# EAGLE design CanBus-8x-Schalter (EAGLE 7.7.0)

## Sheet 1 of 3
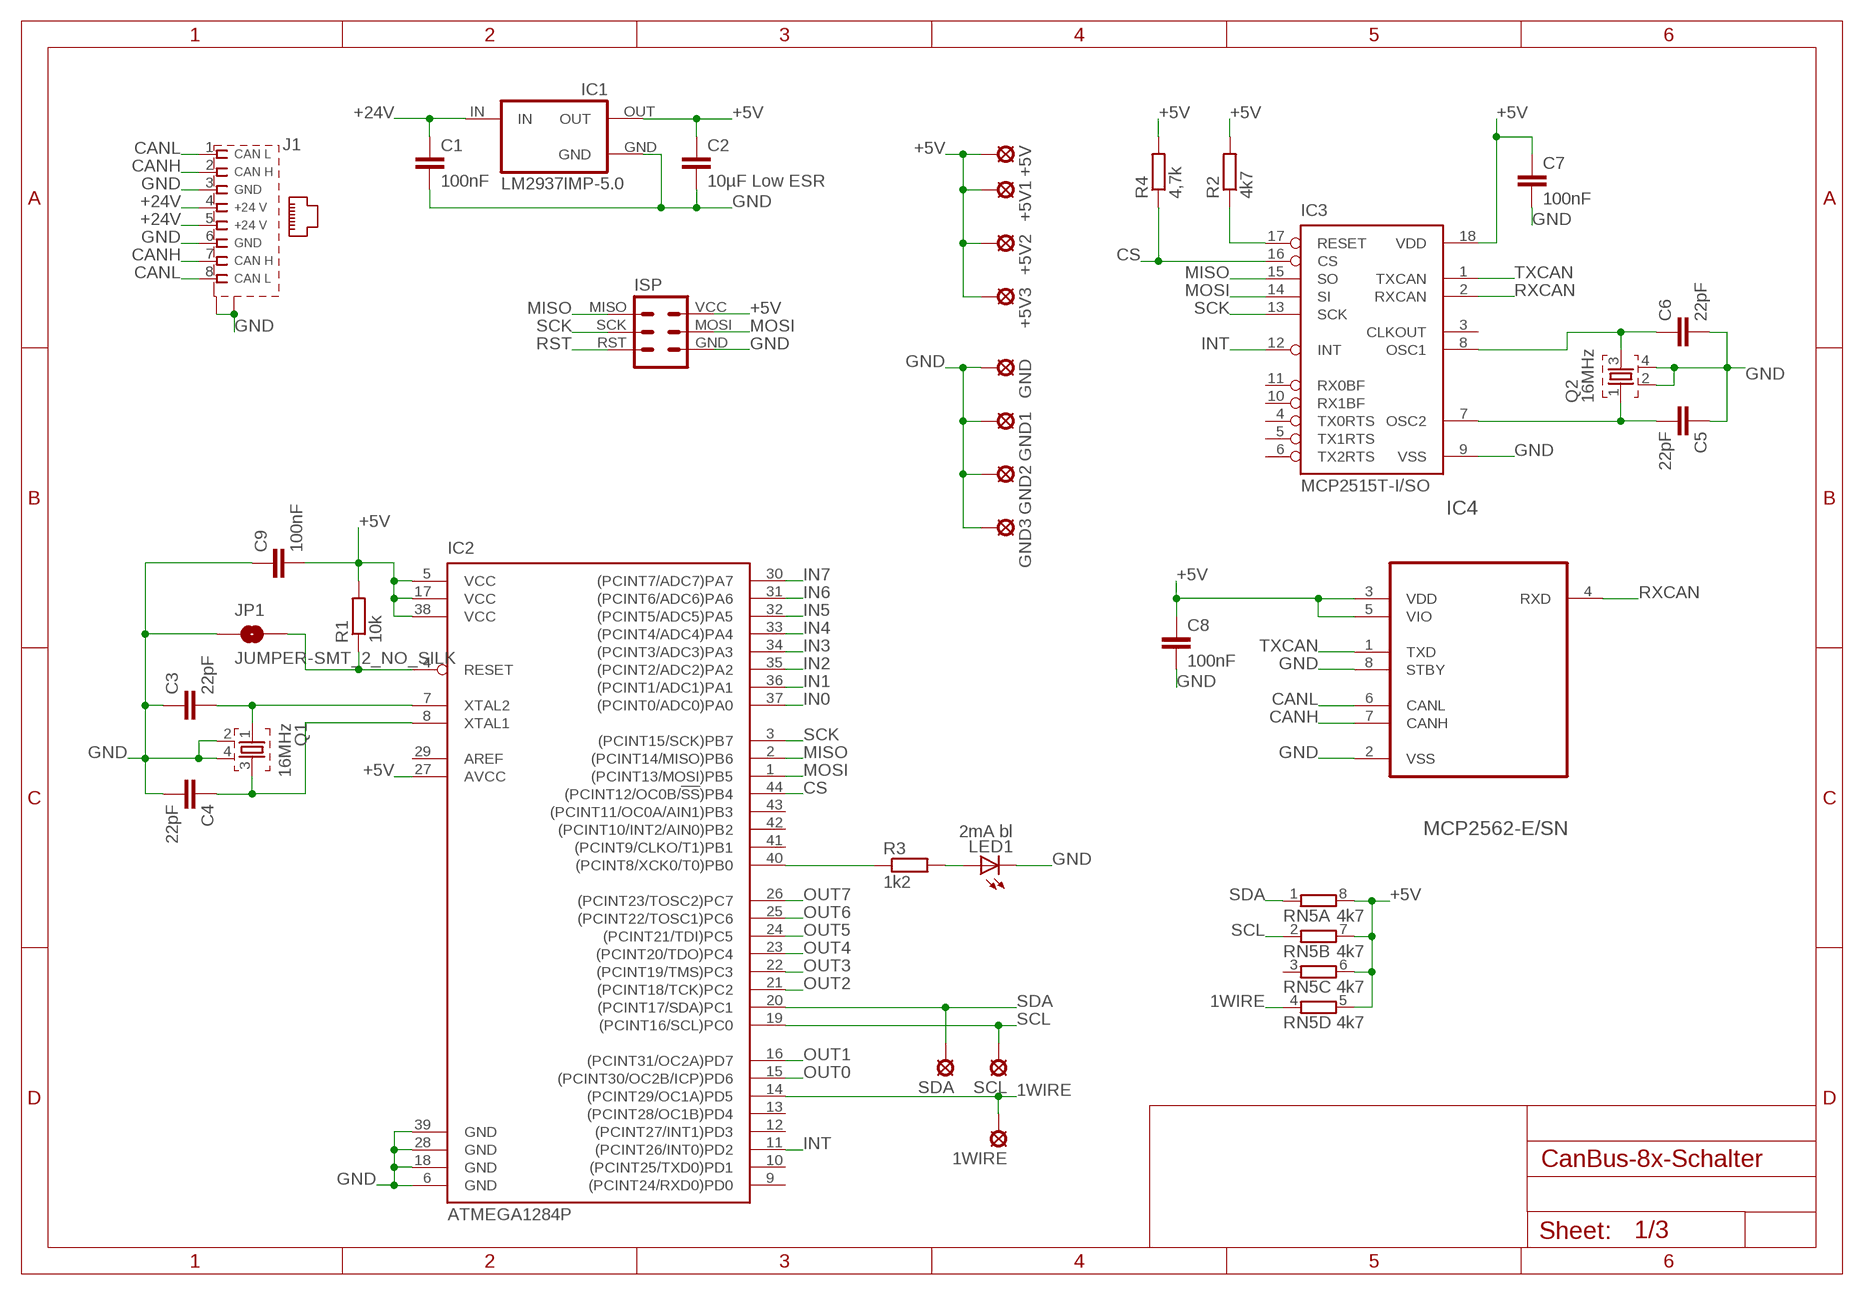
[diagram p0: schematic, sheet 1]

### Parts
1WIRE  LSP13  [LSP13]
+5V  LSP13  [LSP13]
+5V1  LSP13  [LSP13]
+5V2  LSP13  [LSP13]
+5V3  LSP13  [LSP13]
C1  100nF  C-EUC0805  [C0805]
C2  10µF Low ESR  C-EUC0805  [C0805]
C3  22pF  C-EUC0805  [C0805]
C4  22pF  C-EUC0805  [C0805]
C5  22pF  C-EUC0805  [C0805]
C6  22pF  C-EUC0805  [C0805]
C7  100nF  C-EUC0805  [C0805]
C8  100nF  C-EUC0805  [C0805]
C9  100nF  C-EUC0805  [C0805]
GND  LSP13  [LSP13]
GND1  LSP13  [LSP13]
GND2  LSP13  [LSP13]
GND3  LSP13  [LSP13]
IC1  LM2937IMP-5.0  [SOT223]
IC2  ATMEGA1284P  ATMEGA644A  [TQFP44]
IC3  MCP2515T-I/SO  [SO18L]
IC4  MCP2562-E/SN  [SO08]
ISP  ISPVIAS-ONLY-1.27MM  [ISP-VIAS-ONLY-1.27MM]
J1  RJ45-CAN  [MEBP_8-8G]
JP1  JUMPER-SMT_2_NO_SILK  [SMT-JUMPER_2_NO_SILK]
LED1  2mA bl  LEDCHIPLED_1206  [CHIPLED_1206]
Q1  16MHz  EUROQUARTZ-MMJ  [MJ-5X3.2]
Q2  16MHz  EUROQUARTZ-MMJ  [MJ-5X3.2]
R1  10k  R-EU_R0805  [R0805]
R2  4k7  R-EU_R0805  [R0805]
R3  1k2  R-EU_R0805  [R0805]
R4  4,7k  R-EU_R0805  [R0805]
RN5  4k7  4R-N0603-ARC  [0603-ARC]
SCL  LSP13  [LSP13]
SDA  LSP13  [LSP13]

### Nets
1WIRE: 1WIRE.MP IC2.14((PCINT29/OC1A)PD5) RN5.4
+5V: +5V1.MP +5V2.MP +5V3.MP +5V.MP C2.1 C7.1 C8.1 C9.2 IC1.OUT IC2.5(VCC) IC2.17(VCC) IC2.27(AVCC) IC2.38(VCC) IC3.18(VDD) IC4.3(VDD) IC4.5(VIO) ISP.VCC R1.2 R2.2 R4.2 RN5.5 RN5.6 RN5.7 RN5.8 ; also sheet 2
+24V: C1.1 IC1.IN J1.4 J1.5 ; also sheet 3
CANH: IC4.7(CANH) J1.2 J1.7
CANL: IC4.6(CANL) J1.1 J1.8
CS: IC2.44((PCINT12/OC0B/!SS!)PB4) IC3.16(CS) R4.1
GND: C1.2 C2.2 C3.1 C4.2 C5.1 C6.2 C7.2 C8.2 C9.1 GND1.MP GND2.MP GND3.MP GND.MP IC1.GND IC2.6(GND) IC2.18(GND) IC2.28(GND) IC2.39(GND) IC3.9(VSS) IC4.2(VSS) IC4.8(STBY) ISP.GND J1.3 J1.6 J1.G1(S1) J1.G2(S2) JP1.1 LED1.C Q1.2 Q1.4 Q2.2 Q2.4 ; also sheet 2,3
IN0: IC2.37((PCINT0/ADC0)PA0) ; also sheet 2
IN1: IC2.36((PCINT1/ADC1)PA1) ; also sheet 2
IN2: IC2.35((PCINT2/ADC2)PA2) ; also sheet 2
IN3: IC2.34((PCINT3/ADC3)PA3) ; also sheet 2
IN4: IC2.33((PCINT4/ADC4)PA4) ; also sheet 2
IN5: IC2.32((PCINT5/ADC5)PA5) ; also sheet 2
IN6: IC2.31((PCINT6/ADC6)PA6) ; also sheet 2
IN7: IC2.30((PCINT7/ADC7)PA7) ; also sheet 2
INT: IC2.11((PCINT26/INT0)PD2) IC3.12(INT)
MISO: IC2.2((PCINT14/MISO)PB6) IC3.15(SO) ISP.MISO
MOSI: IC2.1((PCINT13/MOSI)PB5) IC3.14(SI) ISP.MOSI
N$1: IC3.17(RESET) R2.1
N$9: IC2.40((PCINT8/XCK0/T0)PB0) R3.1
N$10: LED1.A R3.2
OUT0: IC2.15((PCINT30/OC2B/ICP)PD6) ; also sheet 3
OUT1: IC2.16((PCINT31/OC2A)PD7) ; also sheet 3
OUT2: IC2.21((PCINT18/TCK)PC2) ; also sheet 3
OUT3: IC2.22((PCINT19/TMS)PC3) ; also sheet 3
OUT4: IC2.23((PCINT20/TDO)PC4) ; also sheet 3
OUT5: IC2.24((PCINT21/TDI)PC5) ; also sheet 3
OUT6: IC2.25((PCINT22/TOSC1)PC6) ; also sheet 3
OUT7: IC2.26((PCINT23/TOSC2)PC7) ; also sheet 3
RST: IC2.4(RESET) ISP.RST JP1.2 R1.1
RXCAN: IC3.2(RXCAN) IC4.4(RXD)
SCK: IC2.3((PCINT15/SCK)PB7) IC3.13(SCK) ISP.SCK
SCL: IC2.19((PCINT16/SCL)PC0) RN5.2 SCL.MP
SDA: IC2.20((PCINT17/SDA)PC1) RN5.1 SDA.MP
TXCAN: IC3.1(TXCAN) IC4.1(TXD)
XTAL1: C3.2 IC2.7(XTAL2) Q1.1
XTAL2: C4.1 IC2.8(XTAL1) Q1.3
XTAL3: C5.2 IC3.7(OSC2) Q2.1
XTAL4: C6.1 IC3.8(OSC1) Q2.3
Unconnected: IC2.9((PCINT24/RXD0)PD0) IC2.10((PCINT25/TXD0)PD1) IC2.12((PCINT27/INT1)PD3) IC2.13((PCINT28/OC1B)PD4) IC2.29(AREF) IC2.41((PCINT9/CLKO/T1)PB1) IC2.42((PCINT10/INT2/AIN0)PB2) IC2.43((PCINT11/OC0A/AIN1)PB3) IC3.3(CLKOUT) IC3.4(TX0RTS) IC3.5(TX1RTS) IC3.6(TX2RTS) IC3.10(RX1BF) IC3.11(RX0BF) RN5.3

## Sheet 2 of 3
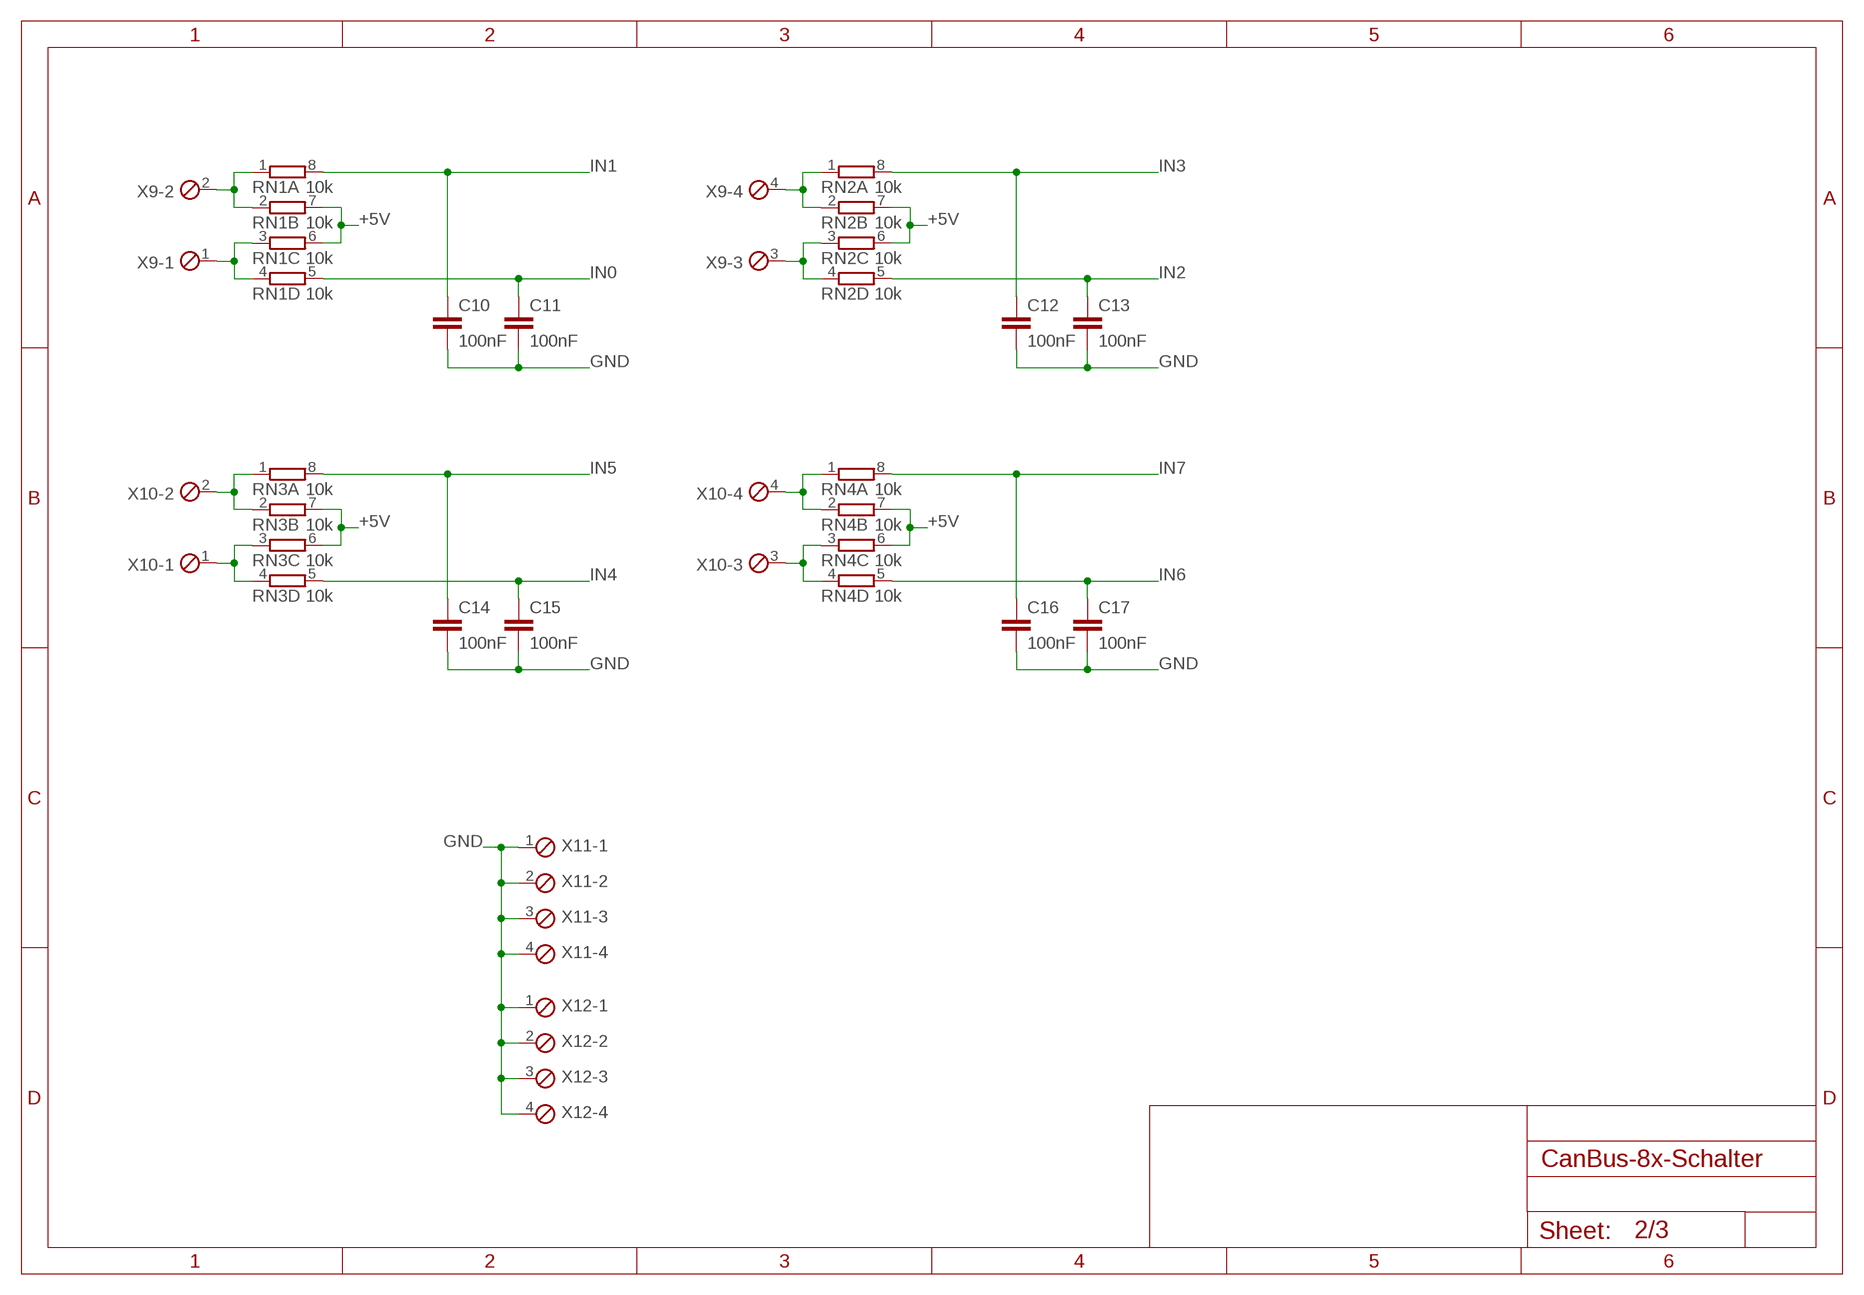
[diagram p1: schematic, sheet 2]

### Parts
C10  100nF  C-EUC0805  [C0805]
C11  100nF  C-EUC0805  [C0805]
C12  100nF  C-EUC0805  [C0805]
C13  100nF  C-EUC0805  [C0805]
C14  100nF  C-EUC0805  [C0805]
C15  100nF  C-EUC0805  [C0805]
C16  100nF  C-EUC0805  [C0805]
C17  100nF  C-EUC0805  [C0805]
RN1  10k  4R-N0603-ARC  [0603-ARC]
RN2  10k  4R-N0603-ARC  [0603-ARC]
RN3  10k  4R-N0603-ARC  [0603-ARC]
RN4  10k  4R-N0603-ARC  [0603-ARC]
X9  MPT4  [4POL254]
X10  MPT4  [4POL254]
X11  MPT4  [4POL254]
X12  MPT4  [4POL254]

### Nets
+5V: RN1.6 RN1.7 RN2.6 RN2.7 RN3.6 RN3.7 RN4.6 RN4.7 ; also sheet 1
GND: C10.2 C11.2 C12.2 C13.2 C14.2 C15.2 C16.2 C17.2 X11.1 X11.2 X11.3 X11.4 X12.1 X12.2 X12.3 X12.4 ; also sheet 1,3
IN0: C11.1 RN1.5 ; also sheet 1
IN1: C10.1 RN1.8 ; also sheet 1
IN2: C13.1 RN2.5 ; also sheet 1
IN3: C12.1 RN2.8 ; also sheet 1
IN4: C15.1 RN3.5 ; also sheet 1
IN5: C14.1 RN3.8 ; also sheet 1
IN6: C17.1 RN4.5 ; also sheet 1
IN7: C16.1 RN4.8 ; also sheet 1
N$2: RN3.3 RN3.4 X10.1
N$3: RN3.1 RN3.2 X10.2
N$5: RN1.3 RN1.4 X9.1
N$6: RN1.1 RN1.2 X9.2
N$7: RN4.3 RN4.4 X10.3
N$8: RN4.1 RN4.2 X10.4
N$26: RN2.3 RN2.4 X9.3
N$27: RN2.1 RN2.2 X9.4

## Sheet 3 of 3
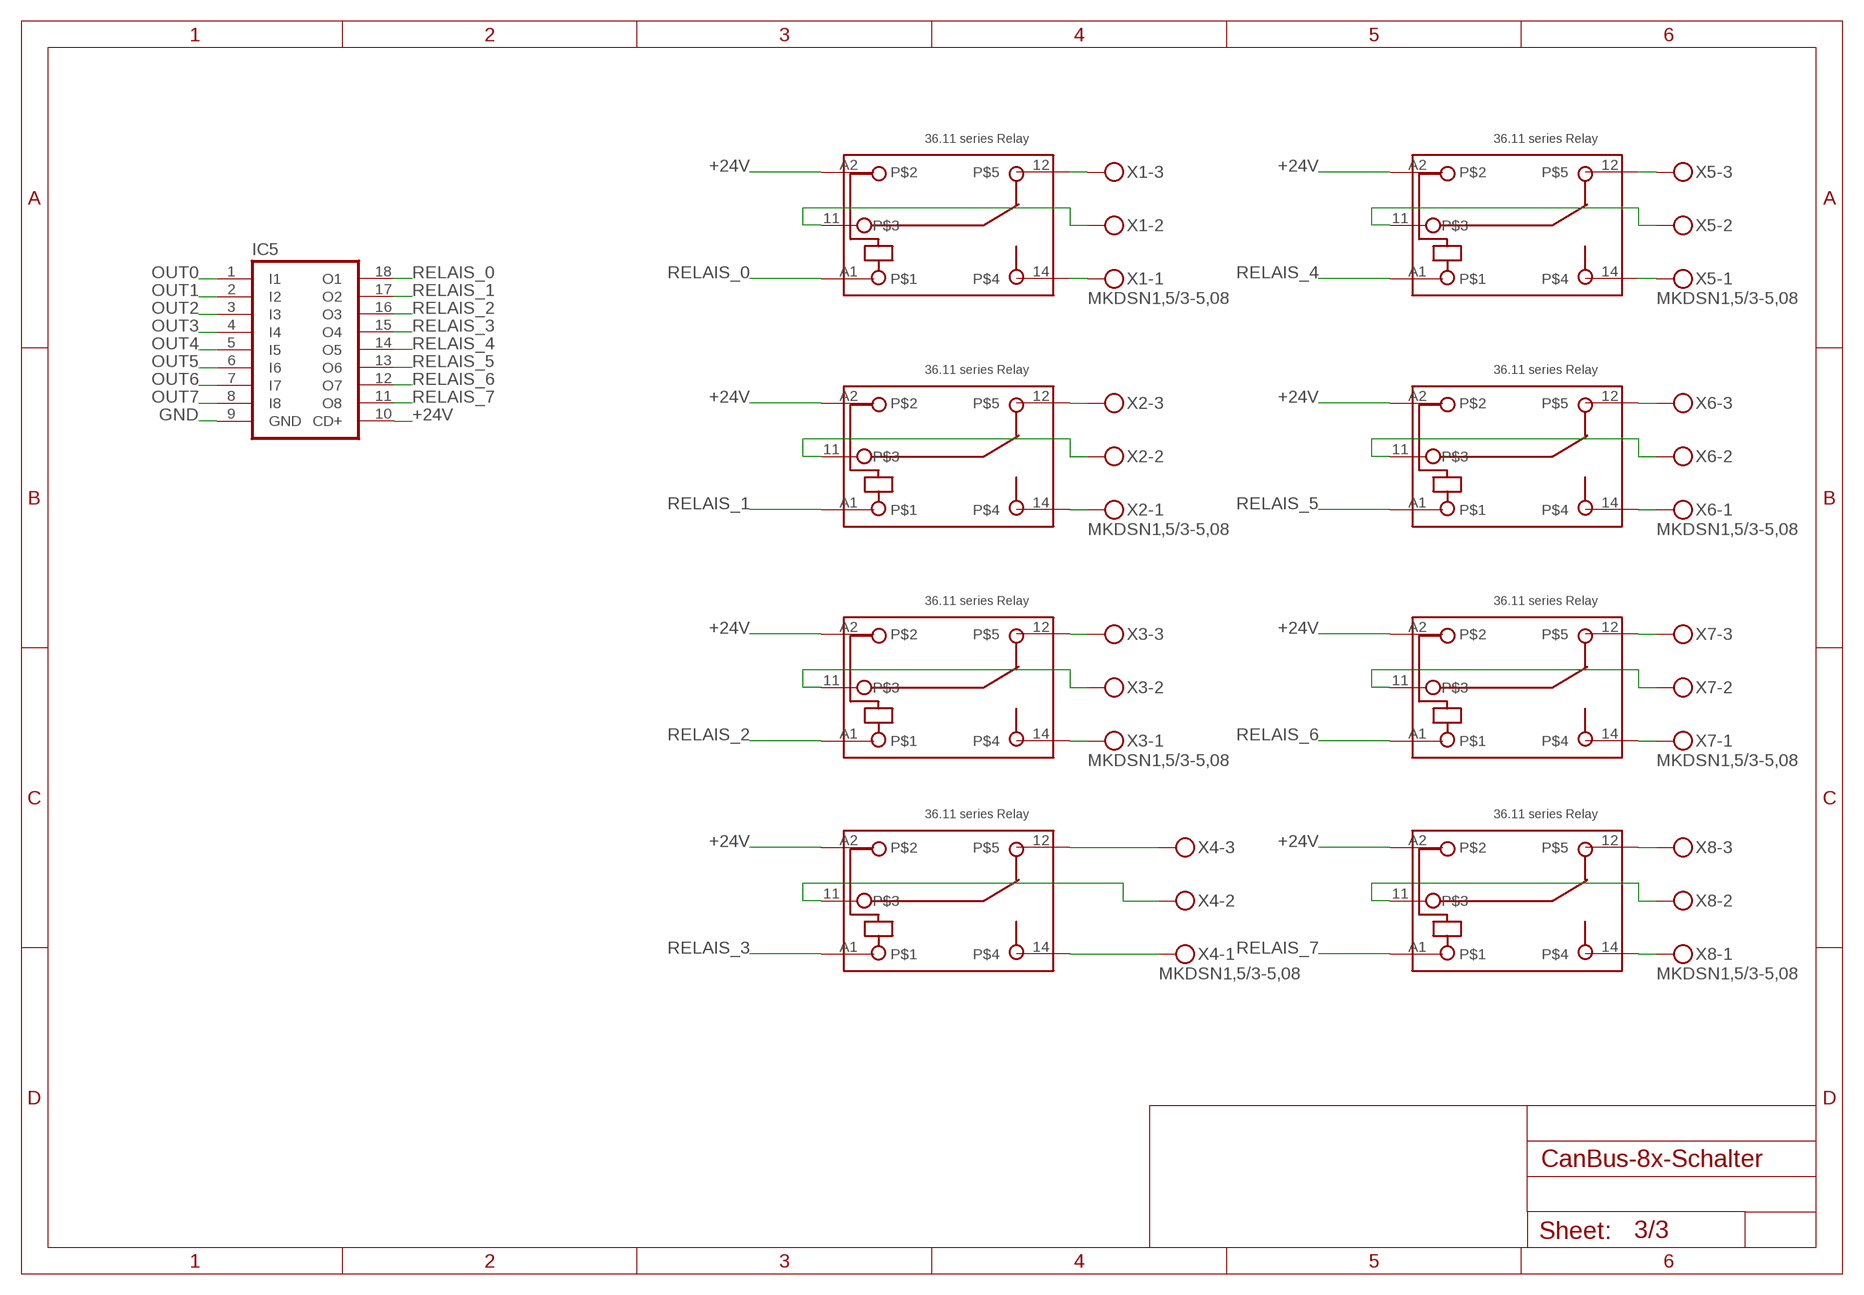
[diagram p2: schematic, sheet 3]

### Parts
IC5  ULN2803A-SO18W  [SO18W]
K1  36.11  [36.11]
K2  36.11  [36.11]
K3  36.11  [36.11]
K4  36.11  [36.11]
K5  36.11  [36.11]
K6  36.11  [36.11]
K7  36.11  [36.11]
K8  36.11  [36.11]
X1  MKDSN1,5/3-5,08  [MKDSN1,5/3-5,08]
X2  MKDSN1,5/3-5,08  [MKDSN1,5/3-5,08]
X3  MKDSN1,5/3-5,08  [MKDSN1,5/3-5,08]
X4  MKDSN1,5/3-5,08  [MKDSN1,5/3-5,08]
X5  MKDSN1,5/3-5,08  [MKDSN1,5/3-5,08]
X6  MKDSN1,5/3-5,08  [MKDSN1,5/3-5,08]
X7  MKDSN1,5/3-5,08  [MKDSN1,5/3-5,08]
X8  MKDSN1,5/3-5,08  [MKDSN1,5/3-5,08]

### Nets
+24V: IC5.10(CD+) K1.A2 K2.A2 K3.A2 K4.A2 K5.A2 K6.A2 K7.A2 K8.A2 ; also sheet 1
GND: IC5.9(GND) ; also sheet 1,2
N$12 [230V]: K2.12 X2.3
N$13 [230V]: K2.14 X2.1
N$14 [230V]: K2.11 X2.2
N$15 [230V]: K1.12 X1.3
N$16 [230V]: K1.14 X1.1
N$17 [230V]: K1.11 X1.2
N$18 [230V]: K3.12 X3.3
N$19 [230V]: K3.14 X3.1
N$20 [230V]: K3.11 X3.2
N$21 [230V]: K4.12 X4.3
N$22 [230V]: K4.14 X4.1
N$23 [230V]: K4.11 X4.2
N$28 [230V]: K6.12 X6.3
N$29 [230V]: K6.14 X6.1
N$30 [230V]: K6.11 X6.2
N$31 [230V]: K5.12 X5.3
N$32 [230V]: K5.14 X5.1
N$33 [230V]: K5.11 X5.2
N$34 [230V]: K7.12 X7.3
N$35 [230V]: K7.14 X7.1
N$36 [230V]: K7.11 X7.2
N$37 [230V]: K8.12 X8.3
N$38 [230V]: K8.14 X8.1
N$39 [230V]: K8.11 X8.2
OUT0: IC5.1(I1) ; also sheet 1
OUT1: IC5.2(I2) ; also sheet 1
OUT2: IC5.3(I3) ; also sheet 1
OUT3: IC5.4(I4) ; also sheet 1
OUT4: IC5.5(I5) ; also sheet 1
OUT5: IC5.6(I6) ; also sheet 1
OUT6: IC5.7(I7) ; also sheet 1
OUT7: IC5.8(I8) ; also sheet 1
RELAIS_0: IC5.18(O1) K1.A1
RELAIS_1: IC5.17(O2) K2.A1
RELAIS_2: IC5.16(O3) K3.A1
RELAIS_3: IC5.15(O4) K4.A1
RELAIS_4: IC5.14(O5) K5.A1
RELAIS_5: IC5.13(O6) K6.A1
RELAIS_6: IC5.12(O7) K7.A1
RELAIS_7: IC5.11(O8) K8.A1

## Power pins joined to a net without a drawn wire
GND: IC1.GND@(GND)

## Library data of the parts
1WIRE +5V +5V1-+5V3 GND GND1-GND3 SCL SDA = solpad:LSP13: SOLDER PAD drill 1.3 mm, distributor Buerklin, 12H562
C1-C17 = rcl:C-EU: CAPACITOR, European symbol
IC1 = lm2937:LM2937IMP-*: 400 and 500 mA Low Dropout Voltage Regulator NATIONAL SEMICONDUCTOR created by Peter.Hofmann@ph-tronic.de <mailto:Reter.Hofmann@ph-tronic.de> 10-2004 Rev.0
IC2 = atmel:ATMEGA644: 8-bit Microcontroller with 64K Bytes In-System Programmable Flash Source: http://www.atmel.com/dyn/resources/prod_documents/doc2593.pdf; MPN: ATMEGA644PV-10AU; OC_FARNELL: 1455123; OC_NEWARK: 58M3748
IC3 = mcp2515_2551_2562:MCP2515
IC4 = mcp2515_2551_2562:MCP2562: High-Speed CAN Transceiver,DIP-8
IC5 = uln-udn:ULN2803A: DRIVER ARRAY
ISP = pogo-isp:ISP: ISP connector pads for Pogo ISP There are variants for mixed pads/vias, pads only and vias.
J1 = can-bus:RJ45-CAN: RJ45 CAN-Bus Reichelt Bestell-Nr.: MEBP 8-8G
JP1 = SparkFun-Jumpers:JUMPER-SMT_2_NO: Normally open jumper This jumper has two pads in close proximity to each other. Apply solder to close the connection. Round pads are easier to solder for beginners, but are a lot larger. SparkFun Product that uses the round pads: SparkFun EL Sequencer <https://www.sparkfun.com/products/12781>
K1-K8 = relay_finder_36_11:36.11: Printed circuit mount miniature 10 A relay one pole changeover contacts Conform RoHS
LED1 = led:LED: LED OSRAM: - CHIPLED LG R971, LG N971, LY N971, LG Q971, LY Q971, LO R971, LY R971 LH N974, LH R974 LS Q976, LO Q976, LY Q976 LO Q996 - Hyper CHIPLED LW Q18S LB Q993, LB Q99A, LB R99A - SideLED LS A670, LO A670, LY A670, LG A670, LP A670 LB A673, LV A673, LT A673, LW A673 LH A674 LY A675 LS A676, LA A676, LO A676, LY A676, LW A676 LS A679, LY A679, LG A679 - Hyper Micro SIDELED® LS Y876, LA Y876, LO Y876, LY Y876 LT Y87S - SmartLED LW L88C, LW L88S LB L89C, LB L89S, LG L890 LS L89K, LO L89K, LY L89K LS L896, LA L896, LO L896, LY L896 - TOPLED LS T670, LO T670, LY T670, LG T670, LP T670 LSG T670, LSP T670, LSY T670, LOP T670, LYG T670 LG T671, LOG T671, LSG T671 LB T673, LV T673, LT T673, LW T673 LH T674 LS T676, LA T676, LO T676, LY T676, LB T676, LH T676, LSB T676, LW T676 LB T67C, LV T67C, LT T67C, LS T67K, LO T67K, LY T67K, LW E67C LS E67B, LA E67B, LO E67B, LY E67B, LB E67C, LV E67C, LT E67C LW T67C LS T679, LY T679, LG T679 LS T770, LO T770, LY T770, LG T770, LP T770 LB T773, LV T773, LT T773, LW T773 LH T774 LS E675, LA E675, LY E675, LS T675 LS T776, LA T776, LO T776, LY T776, LB T776 LHGB T686 LT T68C, LB T68C - Hyper Mini TOPLED® LB M676 - Mini TOPLED Santana® LG M470 LS M47K, LO M47K, LY M47K Source: http://www.osram.convergy.de LUXEON: - LUMILED® LXK2-PW12-R00, LXK2-PW12-S00, LXK2-PW14-U00, LXK2-PW14-V00 LXK2-PM12-R00, LXK2-PM12-S00, LXK2-PM14-U00 LXK2-PE12-Q00, LXK2-PE12-R00, LXK2-PE12-S00, LXK2-PE14-T00, LXK2-PE14-U00 LXK2-PB12-K00, LXK2-PB12-L00, LXK2-PB12-M00, LXK2-PB14-N00, LXK2-PB14-P00, LXK2-PB14-Q00 LXK2-PR12-L00, LXK2-PR12-M00, LXK2-PR14-Q00, LXK2-PR14-R00 LXK2-PD12-Q00, LXK2-PD12-R00, LXK2-PD12-S00 LXK2-PH12-R00, LXK2-PH12-S00 LXK2-PL12-P00, LXK2-PL12-Q00, LXK2-PL12-R00 Source: www.luxeon.com KINGBRIGHT: KA-3528ASYC Source: www.kingbright.com
Q1 Q2 = crystal-smd:EUROQUARTZ-M*: Keramik-SMD-Quarz, 5x7x1,2mm EUROQUARTZ MQ2 Crystal, 4 pad Soruce: MQ <https://cdn-reichelt.de/documents/datenblatt/B400/MQ.pdf>, MJ <https://cdn-reichelt.de/documents/datenblatt/B400/MJ.pdf>; REICHELT: 16,000000-MJ
R1-R4 = rcl:R-EU_: RESISTOR, European symbol
RN1-RN5 = resistor-dil:4R-N: Array Chip Resistor Source: RS Component / Phycomp; OC_FARNELL: unknown; OC_NEWARK: unknown
X1-X8 = con-phoenix-508:MKDSN1,5/3-5,08: MKDSN 1,5/ 3-5,08 Printklemme Nennstrom: 13,5 A Nennspannung: 250 V Rastermaß: 5,08 mm Polzahl: 3 Anschlussart: Schraubanschluss Montage: Löten Anschlussrichtung Leiter/Platine: 0 ° Artikelnummer: 1729131 Source: http://eshop.phoenixcontact.com .. 1729131.pdf
X9-X12 = con-phoenix-254:MPT4: PHOENIX CONNECTOR; OC_FARNELL: unknown; OC_NEWARK: unknown

## Net classes
1 230V: width 2.54 mm, clearance 2.54 mm

## Board
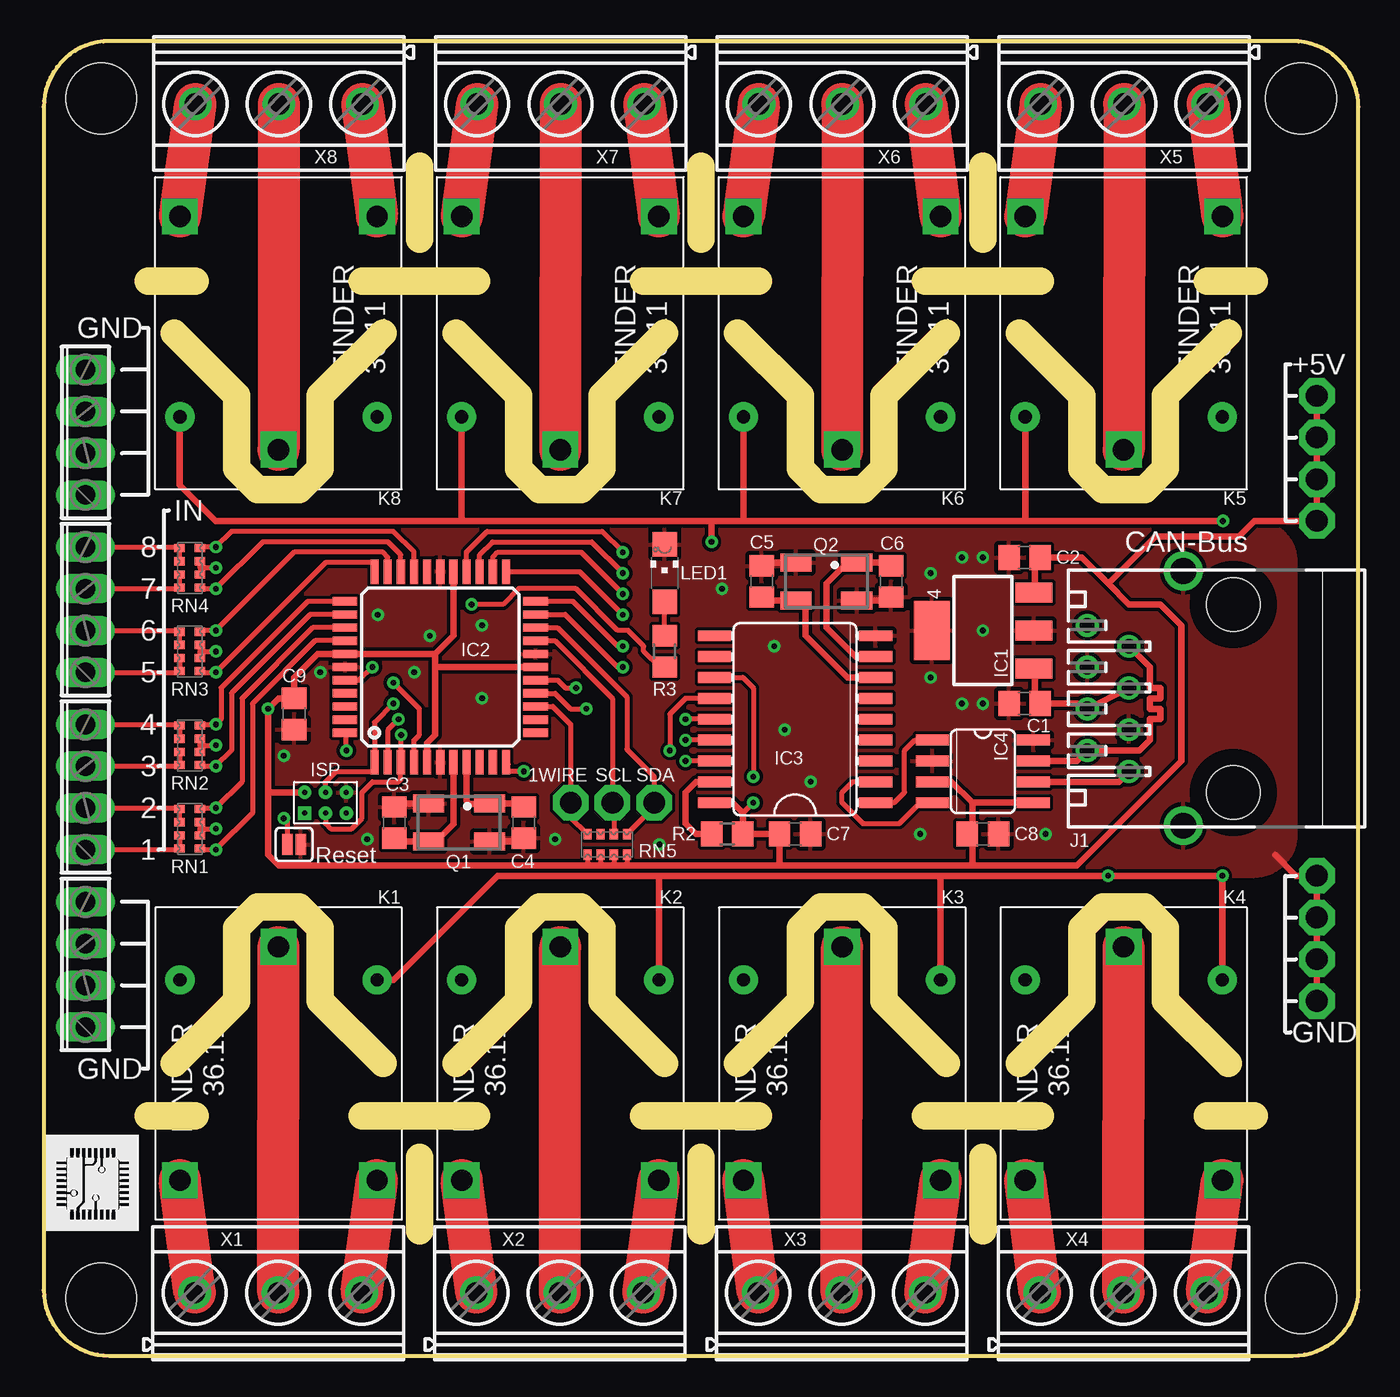
[diagram p3: board, top side]
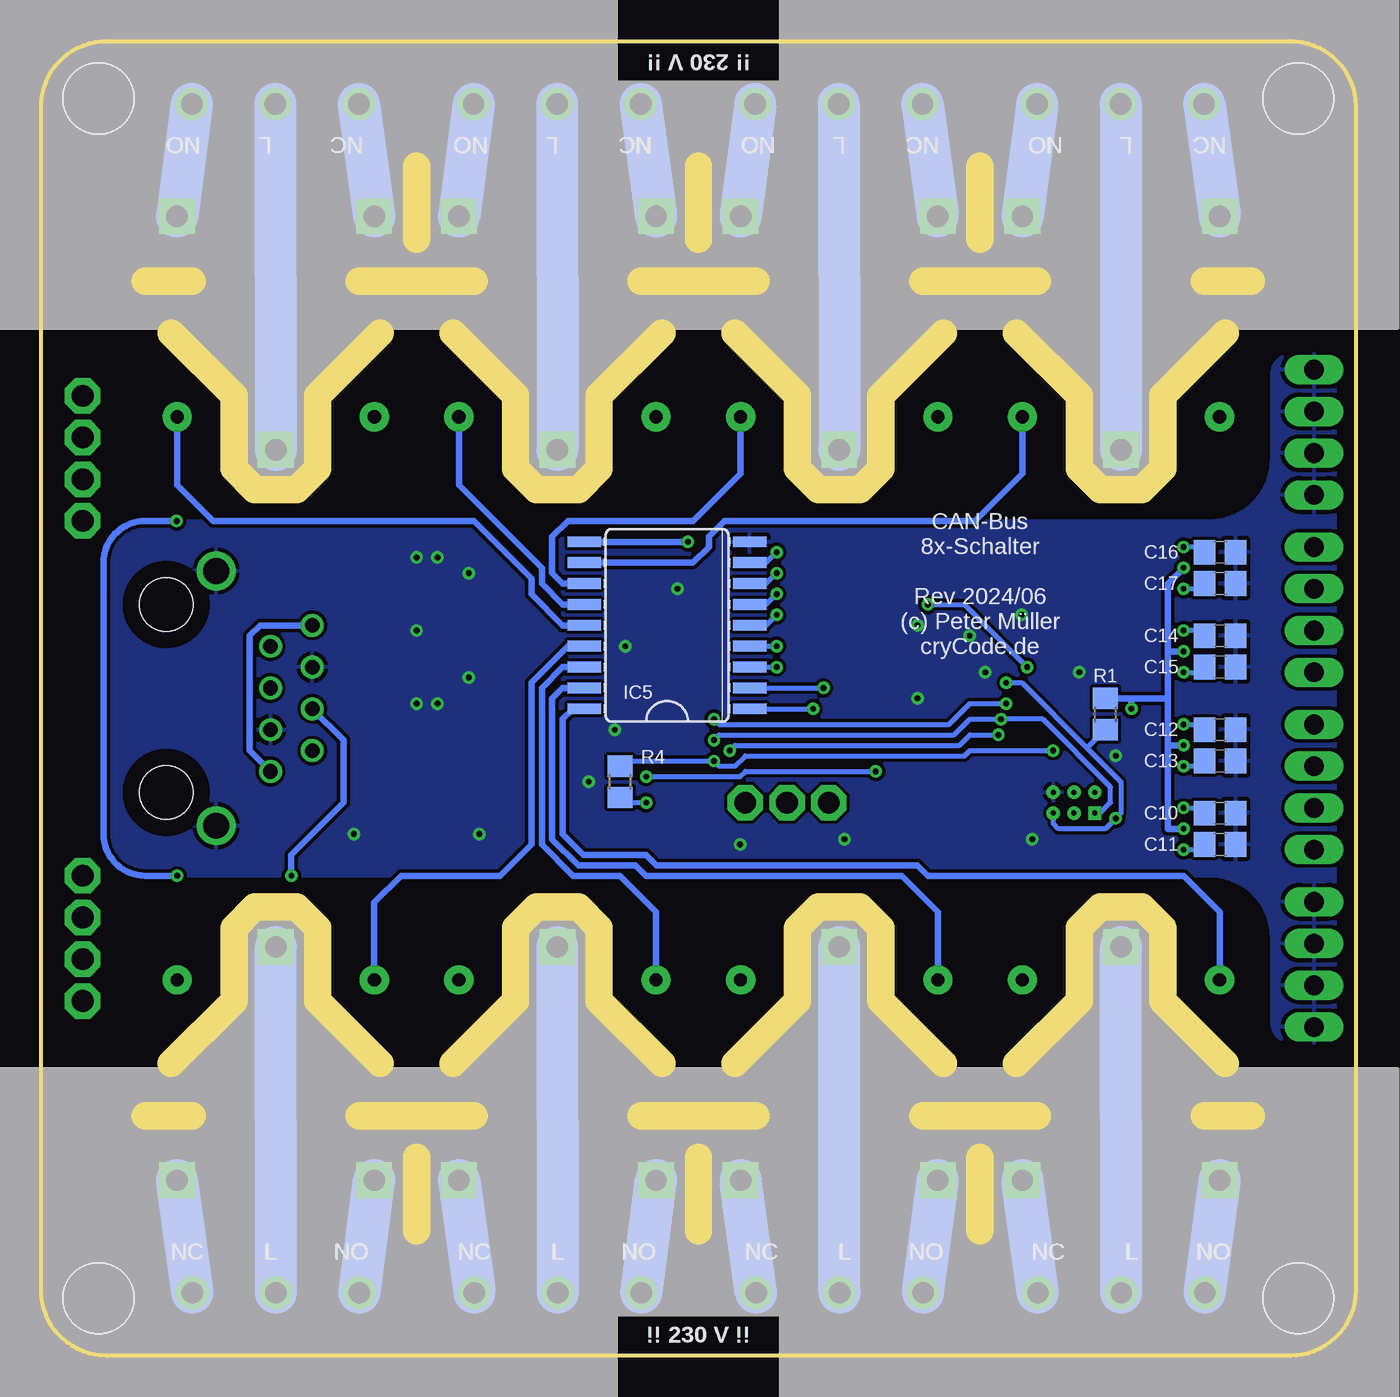
[diagram p4: board, bottom side, seen from below]

Size 80 x 80 mm. Coordinates in mm from the lower left corner, seen from the top.
Outline: 4,0 76,0 arc90 80,4 80,76 arc90 76,80 4,80 arc90 0,76 0,4 arc90 4,0
Copper layers (1*16): Top 0.035mm / dielectric 1.5mm / Bottom 0.035mm
Design rules "allpcb2 *": minimum track width 8mil, minimum drill 0.3mm, track to track 8mil, track to pad 8mil, pad to pad 8mil, via to via 8mil, smd to smd 6mil, copper to edge 40mil, drill to drill 8mil, minimum pad ring 10mil, minimum via ring 8mil, stop-mask expansion 0.1mm, vias tented up to drill 0.5mm, thermal gap 10mil
Holes 4.3 mm at 3.5,3.5 76.5,3.5 76.5,76.5 3.5,76.5
Milling: 72 lines

### Footprints (pad centres in the part's own frame; a part is rotated, then mirrored left to right if it is on the bottom)
LSP13 = drill 1.321 pad 2.159 octagon: MP 0,0
C0805 = smd 1.3 x 1.5: 1 -0.95,0; 2 0.95,0
SOT223 = smd 1.219 x 2.235: GND 0,-3.099; IN -2.311,-3.099; OUT 2.311,-3.099 | smd 3.6 x 2.2: GND@ 0,3.099
TQFP44 = smd 1.5 x 0.5: 1 -5.8,4; 2 -5.8,3.2; 3 -5.8,2.4; 4 -5.8,1.6; 5 -5.8,0.8; 6 -5.8,0; 7 -5.8,-0.8; 8 -5.8,-1.6; 9 -5.8,-2.4; 10 -5.8,-3.2; 11 -5.8,-4; 23 5.8,-4; 24 5.8,-3.2; 25 5.8,-2.4; 26 5.8,-1.6; 27 5.8,-0.8; 28 5.8,0; 29 5.8,0.8; 30 5.8,1.6; 31 5.8,2.4; 32 5.8,3.2; 33 5.8,4 | smd 0.5 x 1.5: 12 -4,-5.8; 13 -3.2,-5.8; 14 -2.4,-5.8; 15 -1.6,-5.8; 16 -0.8,-5.8; 17 0,-5.8; 18 0.8,-5.8; 19 1.6,-5.8; 20 2.4,-5.8; 21 3.2,-5.8; 22 4,-5.8; 34 4,5.8; 35 3.2,5.8; 36 2.4,5.8; 37 1.6,5.8; 38 0.8,5.8; 39 0,5.8; 40 -0.8,5.8; 41 -1.6,5.8; 42 -2.4,5.8; 43 -3.2,5.8; 44 -4,5.8
SO18L = smd 0.66 x 2.032: 1 -5.08,-4.902; 2 -3.81,-4.902; 3 -2.54,-4.902; 4 -1.27,-4.902; 5 0,-4.902; 6 1.27,-4.902; 7 2.54,-4.902; 8 3.81,-4.902; 9 5.08,-4.902; 10 5.08,4.902; 11 3.81,4.902; 12 2.54,4.902; 13 1.27,4.902; 14 0,4.902; 15 -1.27,4.902; 16 -2.54,4.902; 17 -3.81,4.902; 18 -5.08,4.902
SO08 = smd 0.66 x 2.032: 1 -1.905,-3.073; 2 -0.635,-3.073; 3 0.635,-3.073; 4 1.905,-3.073; 5 1.905,3.073; 6 0.635,3.073; 7 -0.635,3.073; 8 -1.905,3.073
SO18W = smd 0.66 x 2.032: 1 -5.08,-5.029; 2 -3.81,-5.029; 3 -2.54,-5.029; 4 -1.27,-5.029; 5 0,-5.029; 6 1.27,-5.029; 7 2.54,-5.029; 8 3.81,-5.029; 9 5.08,-5.029; 10 5.08,5.029; 11 3.81,5.029; 12 2.54,5.029; 13 1.27,5.029; 14 0,5.029; 15 -1.27,5.029; 16 -2.54,5.029; 17 -3.81,5.029; 18 -5.08,5.029
ISP-VIAS-ONLY-1.27MM = drill 0.3 pad 0.762: GND 0.635,-1.27; MOSI 0.635,0; RST -0.635,-1.27; SCK -0.635,0; VCC 0.635,1.27 | drill 0.3 pad 0.762 square: MISO -0.635,1.27
MEBP_8-8G = drill 0.889: 1 -4.445,6.35; 2 -3.175,8.89; 3 -1.905,6.35; 4 -0.635,8.89; 5 0.635,6.35; 6 1.905,8.89; 7 3.175,6.35; 8 4.445,8.89 | drill 1.575 pad 2.184: G1 -7.745,3.05; G2 7.745,3.05 | hole 3.251: -5.715,0; 5.715,0
SMT-JUMPER_2_NO_SILK = smd 0.635 x 1.27: 1 -0.406,0; 2 0.406,0
36.11 = drill 1.3 pad 2.184 square: 11 -7.1,0; 12 7.1,6; 14 7.1,-6 | drill 0.8 pad 1.778: A1 -5.1,-6; A2 -5.1,6
CHIPLED_1206 = smd 1.5 x 1.5: A 0,-1.75; C 0,1.75
MJ-5X3.2 = smd 1.9 x 1.1: 1 -1.85,-1.15; 2 1.85,-1.15; 3 1.85,1.15; 4 -1.85,1.15
R0805 = smd 1.3 x 1.5: 1 -0.95,0; 2 0.95,0
0603-ARC = smd 0.5 x 0.65: 1 -1.2,-0.625; 2 -0.4,-0.625; 3 0.4,-0.625; 4 1.2,-0.625; 5 1.2,0.625; 6 0.4,0.625; 7 -0.4,0.625; 8 -1.2,0.625
MKDSN1,5/3-5,08 = drill 1.3 pad 2: 1 -7.641,0.025; 2 -2.561,0.025; 3 2.519,0.025
4POL254 = drill 1.2 long: 1 -3.81,0; 2 -1.27,0; 3 1.27,0; 4 3.81,0

### Placement (x,y rotation side)
1WIRE  32.07,33.66 0 top
+5V  77.47,50.8 0 top
+5V1  77.47,53.34 0 top
+5V2  77.47,55.88 0 top
+5V3  77.47,58.42 0 top
C1  59.69,39.69 180 top
C2  59.69,48.58 180 top
C3  21.34,32.45 270 top
C4  29.21,32.45 270 top
C5  43.69,47.12 270 top
C6  51.56,47.12 270 top
C7  45.72,31.75 0 top
C8  57.15,31.75 0 top
C9  15.24,39.05 90 top
C10  8.26,33.02 0 bottom
C11  8.26,31.11 0 bottom
C12  8.26,38.1 0 bottom
C13  8.26,36.2 0 bottom
C14  8.26,43.81 0 bottom
C15  8.26,41.91 0 bottom
C16  8.26,48.9 0 bottom
C17  8.26,46.99 0 bottom
GND  77.47,29.21 0 top
GND1  77.47,26.67 0 top
GND2  77.47,24.13 0 top
GND3  77.47,21.59 0 top
IC1  57.15,44.13 90 top
IC2  24.13,41.91 90 top
IC3  45.72,38.73 90 top
IC4  57.15,35.56 270 top
IC5  41.91,44.45 90 bottom
ISP  17.14,33.66 90 top
J1  72.39,40 90 top
JP1  15.24,31.11 180 top
K1  14.29,17.78 270 top
K2  31.43,17.78 270 top
K3  48.58,17.78 270 top
K4  65.72,17.78 270 top
K5  65.72,62.23 90 top
K6  48.58,62.23 90 top
K7  31.43,62.23 90 top
K8  14.29,62.23 90 top
LED1  37.78,47.62 0 top
Q1  25.27,32.45 0 top
Q2  47.62,47.12 0 top
R1  15.24,39.05 90 bottom
R2  41.59,31.75 0 top
R3  37.78,42.86 90 top
R4  44.77,34.92 270 bottom
RN1  8.89,32.07 270 top
RN2  8.89,37.15 270 top
RN3  8.89,42.86 270 top
RN4  8.89,47.94 270 top
RN5  34.29,31.11 180 top
SCL  34.61,33.66 0 top
SDA  37.15,33.66 0 top
U$1  [30MM_LOGO]  0,7.62 0 top
X1  16.83,3.81 0 top
X2  33.97,3.81 0 top
X3  51.12,3.81 0 top
X4  68.26,3.81 0 top
X5  63.18,76.2 180 top
X6  46.04,76.2 180 top
X7  28.89,76.2 180 top
X8  11.75,76.2 180 top
X9  2.54,34.61 90 top
X10  2.54,45.4 90 top
X11  2.54,56.2 90 top
X12  2.54,23.81 90 top

### Tracks (layer width: path | path; a pad name or v marks a point on that pad's centre or on a via)
1WIRE
  Top 0.305: IC2.14 30.98,39.51 32.07,38.42 1WIRE.MP 32.07,32.76 RN5.4
+5V  (via drill 0.35 pad 0.7)
  Top 0.305: RN1.7 RN1.6 9.52,32.07 v10.48,32.07 | RN4.6 RN4.7 9.52,47.94 v10.48,47.94 | RN3.7 RN3.6 9.52,42.86 v10.48,42.86 | RN2.6 RN2.7 9.52,37.15 v10.48,37.15 | RN5.8 35.49,29.84 35.56,29.84 | RN5.7 34.69,29.84 34.29,29.84 33.89,29.84 RN5.6 | RN5.5 33.09,29.84 33.02,29.84 | v43.18,33.66 42.55,33.02 42.54,33.02
  Top 0.406: IC1.OUT 60.45,46.65 60.33,46.78 60.33,48.26 C2.1 | 40.32,33.66 IC3.18 41.91,33.66 42.54,33.02 R2.2 C7.1 44.77,29.84 | 56.52,33.66 55.24,34.92 IC4.3 | IC4.5 56.52,33.66 | 60.33,48.89 C2.1 | IC2.5 23.33,37.3 23.81,37.78 23.81,41.91 | 44.77,29.84 35.56,29.84 34.29,29.84 33.02,29.84 14.29,29.84 13.65,30.48 13.65,34.29 | 44.77,29.84 56.52,29.84 | 64.77,46.99 66.04,45.72 67.94,45.72 69.22,44.45 69.22,36.2 62.87,29.84 56.52,29.84 | 64.77,46.99 63.18,48.58 C2.1 | 56.52,29.84 56.52,31.75 C8.1 56.52,31.75 56.52,33.66 | 23.81,42.71 IC2.38 16.68,42.71 15.24,41.27 C9.2 14.93,40.01 14.29,40.01 v13.65,39.37 13.65,34.29 | 23.81,41.91 IC2.17 | IC2.27 24.93,43.83 23.81,42.71 | 23.81,41.91 23.81,42.71 | +5V3.MP +5V2.MP +5V1.MP +5V.MP 73.66,50.8 72.71,49.85 67.63,49.85 64.77,46.99 | ISP.VCC 13.65,34.29
  Bottom 0.305: R4.2 44.45,33.66 v43.18,33.66
  Bottom 0.406: 11.43,37.15 11.43,32.07 v10.48,32.07 | 11.43,37.15 11.43,40.01 | 11.43,40.01 11.43,42.86 | 11.43,42.86 11.43,46.99 v10.48,47.94 | v10.48,42.86 11.43,42.86 | v10.48,37.15 11.43,37.15 | 13.65,40.01 C9.2 | 13.65,40.01 11.43,40.01 | v13.65,39.37 13.65,40.01
+24V  (via drill 0.35 pad 0.7)
  Top 0.406: IC1.IN 60.45,41.62 60.33,41.49 60.33,40 C1.1 | 60.33,39.37 C1.1 | K8.A2 8.29,52.99 10.48,50.8 25.43,50.8 | 25.43,50.8 40.64,50.8 | 40.64,50.8 42.58,50.8 | 42.58,50.8 59.72,50.8 | 59.72,50.8 v71.75,50.8 | K7.A2 25.43,50.8 | K6.A2 42.58,50.8 | K5.A2 59.72,50.8 | K1.A2 21.29,22.88 27.62,29.21 37.43,29.21 | 37.43,29.21 54.58,29.21 | 54.58,29.21 v64.77,29.21 v71.72,29.21 K4.A2 | K2.A2 37.43,29.21 | K3.A2 54.58,29.21 | v40.64,49.53 40.64,50.8 | C1.1 62.87,39.69 J1.4 J1.5
  Bottom 0.406: IC5.10 v40.64,49.53 | J1.4 61.59,37.47 61.59,33.66 64.77,30.48 v64.77,29.21 | v71.72,29.21 73.66,29.21 arc90 76.2,31.75 76.2,48.26 arc90 73.66,50.8 v71.75,50.8
BOT
  pour Bottom: 74.3,42.23 74.3,37.78 72.39,37.78 72.39,42.23
CANH
  Top 0.406: J1.7 67.31,41.91 67.31,40.64 67.94,40.64 67.94,40.01 67.31,40.01 67.31,39.37 67.94,39.37 67.94,38.73 67.31,38.73 67.31,37.47 66.67,36.83 J1.2 62.87,36.2 IC4.7
CANL
  Top 0.406: IC4.6 65.41,34.92 J1.1
  Bottom 0.406: J1.8 66.68,44.45 67.31,43.81 67.31,36.83 J1.1
CS  (via drill 0.35 pad 0.7)
  Top 0.305: IC3.16 v39.05,36.2 | v18.41,36.83 18.41,37.83
  Top 0.406: 18.41,37.83 IC2.44
  Bottom 0.305: v18.41,36.83 23.5,36.83 23.81,36.51 37.15,36.51 37.78,35.88 38.73,35.88 v39.05,36.2 44.45,36.2 R4.1
GND  (via drill 0.35 pad 0.7)
  Top 0.406: Q1.2 29.01,31.3 C4.2 | Q1.4 21.54,33.6 C3.1 | Q2.2 51.36,45.97 C6.2 | Q2.4 43.89,48.27 C5.1 | GND3.MP GND2.MP GND1.MP GND.MP 76.2,29.21 74.93,30.48
  other vias: 57.15,39.69 57.15,48.58 57.15,44.13 19.68,31.43 31.11,31.43 20.32,45.09 26.67,44.45 26.67,40.01 22.54,41.59 53.98,47.62 53.98,41.27 41.27,46.67 46.67,34.92 37.47,31.11 60.96,31.75 53.34,31.75 44.45,43.18 55.88,48.58 55.88,39.69 45.09,38.1 16.83,41.59 14.61,36.51 23.5,43.81
  pour Bottom: -2.54,60.96 -2.54,19.05 3.81,19.05 arc90 5.08,20.32 5.08,25.4 arc-90 8.89,29.21 76.2,29.21 76.2,50.8 8.89,50.8 arc-90 5.08,54.61 5.08,59.69 arc90 3.81,60.96
  pour Top: -2.54,50.8 -2.54,29.21 73.66,29.21 arc90 76.2,31.75 76.2,48.26 arc90 73.66,50.8
IN0  (via drill 0.35 pad 0.7)
  Top 0.305: RN1.5 9.59,30.8 v10.48,30.8 12.7,33.02 12.7,39.69 16.52,43.51 IC2.37
  Bottom 0.305: v10.48,30.8 9.52,30.8 C11.1
IN1  (via drill 0.35 pad 0.7)
  Top 0.305: RN1.8 9.59,33.34 v10.48,33.34 12.06,34.92 12.06,40.01 16.37,44.31 IC2.36
  Bottom 0.305: v10.48,33.34 9.52,33.34 C10.1
IN2  (via drill 0.35 pad 0.7)
  Top 0.305: RN2.5 9.59,35.88 v10.48,35.88 11.43,36.83 11.43,40.32 16.22,45.11 IC2.35
  Bottom 0.305: v10.48,35.88 9.52,35.88 C13.1
IN3  (via drill 0.35 pad 0.7)
  Top 0.305: RN2.8 9.59,38.42 v10.48,38.42 10.79,38.73 10.79,40.64 16.07,45.91 IC2.34
  Bottom 0.305: v10.48,38.42 9.52,38.42 C12.1
IN4  (via drill 0.35 pad 0.7)
  Top 0.305: RN3.5 9.59,41.59 v10.48,41.59 17.14,48.26 20,48.26 20.13,48.13 IC2.33
  Bottom 0.305: v10.48,41.59 9.52,41.59 C15.1
IN5  (via drill 0.35 pad 0.7)
  Top 0.305: RN3.8 9.59,44.13 v10.48,44.13 15.24,48.9 20.64,48.9 20.93,48.6 IC2.32
  Bottom 0.305: C14.1 9.52,44.13 v10.48,44.13
IN6  (via drill 0.35 pad 0.7)
  Top 0.305: IC2.31 21.73,48.76 20.95,49.53 13.34,49.53 v10.48,46.67 9.59,46.67 RN4.5
  Bottom 0.305: v10.48,46.67 9.52,46.67 C17.1
IN7  (via drill 0.35 pad 0.7)
  Top 0.305: IC2.30 22.53,48.91 21.27,50.16 11.43,50.16 v10.48,49.21 9.59,49.21 RN4.8
  Bottom 0.305: C16.1 9.52,49.21 v10.48,49.21
INT  (via drill 0.35 pad 0.7)
  Top 0.305: IC3.12 42.55,41.27 43.18,40.64 v43.18,35.24 | v29.21,35.56 28.26,35.56 28.26,35.98 IC2.11
  Bottom 0.305: v43.18,35.24 37.47,35.24 37.15,35.56 v29.21,35.56
MISO  (via drill 0.35 pad 0.7)
  Top 0.305: v21.59,38.73 20.93,38.08 IC2.2 | IC3.15 v39.05,37.47
  Bottom 0.305: v39.05,37.47 38.73,37.78 24.45,37.78 23.5,38.73 v21.59,38.73 19.05,38.73 14.92,34.61 14.92,33.66 15.56,33.02 ISP.MISO
MOSI  (via drill 0.35 pad 0.7)
  Top 0.305: IC3.14 v39.05,38.73 | v21.27,39.69 20.13,38.55 IC2.1 | ISP.MOSI 17.14,34.92 17.78,35.56 20,35.56 20.13,35.69
  Top 0.406: 20.13,35.69 IC2.1
  Bottom 0.305: v39.05,38.73 38.73,38.42 24.77,38.42 23.5,39.69 v21.27,39.69
N$1
  Top 0.406: R2.1 39.69,31.75 39.05,32.38 39.05,34.29 39.69,34.92 IC3.17
N$2
  Top 0.305: RN3.3 RN3.4 8.2,41.59 X10.1
N$3
  Top 0.305: RN3.2 RN3.1 8.2,44.13 X10.2
N$5
  Top 0.305: RN1.3 RN1.4 8.2,30.8 X9.1
N$6
  Top 0.305: RN1.2 RN1.1 8.2,33.34 X9.2
N$7
  Top 0.305: RN4.3 RN4.4 8.2,46.67 X10.3
N$8
  Top 0.305: RN4.2 RN4.1 8.2,49.21 X10.4
N$9  (via drill 0.35 pad 0.7)
  Top 0.305: R3.1 37.46,41.91 36.51,42.86 36.51,43.18 35.56,44.13 34.92,44.13 32.38,46.67 28.89,46.67 27.94,45.72 v26.04,45.72 | v20,41.91 19.2,41.11 IC2.40
  Bottom 0.305: v26.04,45.72 23.81,45.72 v20,41.91
N$10
  Top 0.305: R3.2 LED1.A
N$12
  Top 2.54: X2.3 K2.12
  Bottom 2.54: X2.3 K2.12
N$13
  Top 2.54: X2.1 K2.14
  Bottom 2.54: X2.1 K2.14
N$14
  Top 2.54: X2.2 K2.11
  Bottom 2.54: X2.2 K2.11
N$15
  Top 2.54: X1.3 K1.12
  Bottom 2.54: X1.3 K1.12
N$16
  Top 2.54: X1.1 K1.14
  Bottom 2.54: X1.1 K1.14
N$17
  Top 2.54: X1.2 K1.11
  Bottom 2.54: X1.2 K1.11
N$18
  Top 2.54: K3.12 X3.3
  Bottom 2.54: K3.12 X3.3
N$19
  Top 2.54: X3.1 K3.14
  Bottom 2.54: X3.1 K3.14
N$20
  Top 2.54: X3.2 K3.11
  Bottom 2.54: X3.2 K3.11
N$21
  Top 2.54: X4.3 K4.12
  Bottom 2.54: X4.3 K4.12
N$22
  Top 2.54: X4.1 K4.14
  Bottom 2.54: X4.1 K4.14
N$23
  Top 2.54: X4.2 K4.11
  Bottom 2.54: X4.2 K4.11
N$26
  Top 0.305: RN2.3 RN2.4 8.2,35.88 X9.3
N$27
  Top 0.305: RN2.2 RN2.1 8.2,38.42 X9.4
N$28
  Top 2.54: X6.3 K6.12
  Bottom 2.54: X6.3 K6.12
N$29
  Top 2.54: X6.1 K6.14
  Bottom 2.54: X6.1 K6.14
N$30
  Top 2.54: X6.2 K6.11
  Bottom 2.54: X6.2 K6.11
N$31
  Top 2.54: X5.3 K5.12
  Bottom 2.54: X5.3 K5.12
N$32
  Top 2.54: X5.1 K5.14
  Bottom 2.54: X5.1 K5.14
N$33
  Top 2.54: X5.2 K5.11
  Bottom 2.54: X5.2 K5.11
N$34
  Top 2.54: X7.3 K7.12
  Bottom 2.54: X7.3 K7.12
N$35
  Top 2.54: X7.1 K7.14
  Bottom 2.54: X7.1 K7.14
N$36
  Top 2.54: X7.2 K7.11
  Bottom 2.54: X7.2 K7.11
N$37
  Top 2.54: X8.3 K8.12
  Bottom 2.54: X8.3 K8.12
N$38
  Top 2.54: X8.1 K8.14
  Bottom 2.54: X8.1 K8.14
N$39
  Top 2.54: X8.2 K8.11
  Bottom 2.54: X8.2 K8.11
OUT0  (via drill 0.35 pad 0.7)
  Top 0.305: IC2.15 31.13,40.31 32.07,39.37 v33.02,39.37
  Bottom 0.305: IC5.1 v33.02,39.37
OUT1  (via drill 0.35 pad 0.7)
  Top 0.305: IC2.16 31.28,41.11 31.75,40.64 v32.38,40.64
  Bottom 0.305: IC5.2 v32.38,40.64
OUT2  (via drill 0.35 pad 0.7)
  Top 0.305: IC2.21 31.73,45.11 34.92,41.91 v35.24,41.91
  Bottom 0.305: IC5.3 v35.24,41.91
OUT3  (via drill 0.35 pad 0.7)
  Top 0.305: v35.24,43.18 34.92,43.18 32.2,45.91 IC2.22
  Bottom 0.305: IC5.4 v35.24,43.18
OUT4  (via drill 0.35 pad 0.7)
  Top 0.305: IC2.23 32.62,47.71 v35.24,45.09
  Bottom 0.305: IC5.5 35.88,44.45 v35.24,45.09
OUT5  (via drill 0.35 pad 0.7)
  Top 0.305: IC2.24 27.33,48.6 27.62,48.9 32.7,48.9 v35.24,46.35
  Bottom 0.305: IC5.6 35.88,45.72 v35.24,46.35
OUT6  (via drill 0.35 pad 0.7)
  Top 0.305: IC2.25 26.53,48.76 27.3,49.53 33.34,49.53 v35.24,47.62
  Bottom 0.305: IC5.7 35.88,46.99 v35.24,47.62
OUT7  (via drill 0.35 pad 0.7)
  Top 0.305: IC2.26 25.73,48.91 26.99,50.16 33.97,50.16 v35.24,48.9
  Bottom 0.305: IC5.8 35.88,48.26 v35.24,48.9
RELAIS_0
  Bottom 0.406: K1.A1 8.29,27.02 10.48,29.21 26.04,29.21 26.67,29.84 42.55,29.84 43.18,30.48 46.99,30.48 48.26,31.75 48.26,38.73 47.62,39.37 IC5.18
RELAIS_1
  Bottom 0.406: IC5.17 48.26,40.64 48.9,40.01 48.9,31.43 47.31,29.84 43.81,29.84 43.18,29.21 27.62,29.21 25.43,27.02 K2.A1
RELAIS_2
  Bottom 0.406: IC5.16 48.26,41.91 49.53,40.64 49.53,31.11 47.62,29.21 44.77,29.21 42.58,27.02 K3.A1
RELAIS_3
  Bottom 0.406: IC5.15 47.94,43.18 50.16,40.96 50.16,31.11 52.07,29.21 58.1,29.21 59.72,27.59 K4.A1
RELAIS_4
  Bottom 0.406: IC5.14 48.26,44.45 50.16,46.35 50.16,47.31 53.66,50.8 69.53,50.8 71.72,52.99 K5.A1
RELAIS_5
  Bottom 0.406: K6.A1 54.58,52.99 49.53,47.94 49.53,46.99 48.26,45.72 IC5.13
RELAIS_6
  Bottom 0.406: IC5.12 48.26,46.99 48.9,47.62 48.9,49.85 47.94,50.8 40.32,50.8 37.43,53.69 K7.A1
RELAIS_7
  Bottom 0.406: K8.A1 20.29,53.69 23.18,50.8 38.42,50.8 39.37,49.85 39.37,49.21 40.32,48.26 IC5.11
RST  (via drill 0.35 pad 0.7)
  Top 0.305: IC2.4 22.53,37.45 22.86,37.78 22.86,39.37 v21.27,40.96 | JP1.2 14.83,32.47 v14.61,32.7
  Bottom 0.305: v21.27,40.96 20.32,40.96 16.35,36.99 | 16.35,36.99 14.29,34.92 14.29,33.02 v14.61,32.7 15.24,32.07 18.1,32.07 18.41,32.38 ISP.RST | R1.1 16.35,36.99
  Bottom 0.406: R1.1
RXCAN
  Top 0.305: IC3.2 49.21,34.92 48.58,34.29 48.58,33.66 49.85,32.38 52.07,32.38 53.34,33.66 IC4.4
SCK  (via drill 0.35 pad 0.7)
  Top 0.305: v21.75,37.78 21.73,37.6 IC2.3 21.73,35.06 21.59,34.92 20,34.92 19.37,34.29 19.37,32.7 18.73,32.07 17.46,32.07 17.14,32.38 ISP.SCK | IC3.13 39.05,40.01 38.1,39.05 v38.1,36.83
  Bottom 0.305: v38.1,36.83 37.78,37.15 24.13,37.15 23.5,37.78 v21.75,37.78
SCL
  Top 0.305: RN5.2 34.69,33.57 SCL.MP 34.61,40.01 31.1,43.51 IC2.19
SDA
  Top 0.305: RN5.1 37.15,33.4 SDA.MP 37.15,35.24 35.49,36.9 35.49,40.08 31.25,44.31 IC2.20
TOP
  pour Top: 74.3,42.23 74.3,37.78 72.39,37.78 72.39,42.23
TXCAN
  Top 0.305: IC3.1 51.75,33.66 52.39,34.29 52.39,36.83 53.02,37.47 IC4.1
XTAL1
  Top 0.406: C3.2 21.54,31.3 Q1.1 23.56,31.43 24,31.43 24.93,32.36 IC2.7
XTAL2
  Top 0.406: C4.1 29.01,33.6 Q1.3 25.91,33.59 25.73,33.77 IC2.8
XTAL3
  Top 0.406: IC3.7 48.9,41.27 46.35,43.81 46.35,45.72 46.09,45.72 Q2.1 43.89,45.97 C5.2
XTAL4
  Top 0.406: IC3.8 49.4,42.55 47.62,44.32 47.62,46.99 48.97,48.33 Q2.3 51.36,48.27 C6.1

### Text on the board
bPlace: !! 230 V !! | NC | L | NO | NC | L | NO | NC | L | NO | NC | L | NO | CAN-Bus / 8x-Schalter / / Rev 2024/06 / (c) Peter Müller / cryCode.de | NO | L | NC | NO | L | NC | NO | L | NC | NO | L | NC | !! 230 V !!
tNames: GND | IN | 8 | CAN-Bus | 7 | 6 | 5 | 4 | 3 | 2 | 1 | Reset | GND
tRestrict: TOP
bRestrict: BOT